# Altium schematic sheet PreOut.SchDoc
size A4
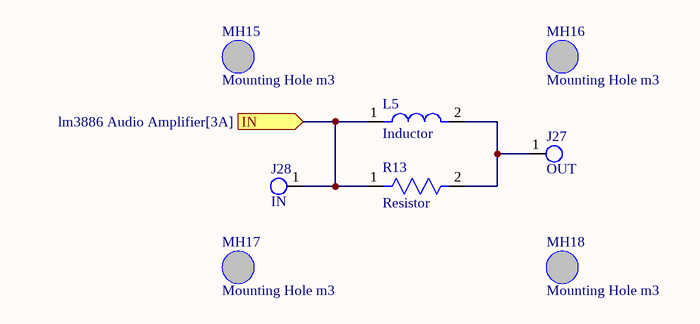
[diagram p0: PreOut.SchDoc]

## Parts
J27  OUT  [Terminal 6.3mm male]
J28  IN  [Terminal 6.3mm male]
L5  Inductor  [Inductor p26]
MH15  Mounting Hole m3  [Mounting Hole]
MH16  Mounting Hole m3  [Mounting Hole]
MH17  Mounting Hole m3  [Mounting Hole]
MH18  Mounting Hole m3  [Mounting Hole]
R13  Resistor  [Resistor 0823 5W]

## Ports
IN (in, see lm3886 Audio Amplifier[3A])

## Nets
IN: J28.1 L5.1 R13.1 ; port IN
NetJ27_1: J27.1 L5.2 R13.2

## Library data of the parts
J27 J28 = 6.3mm Male Terminal